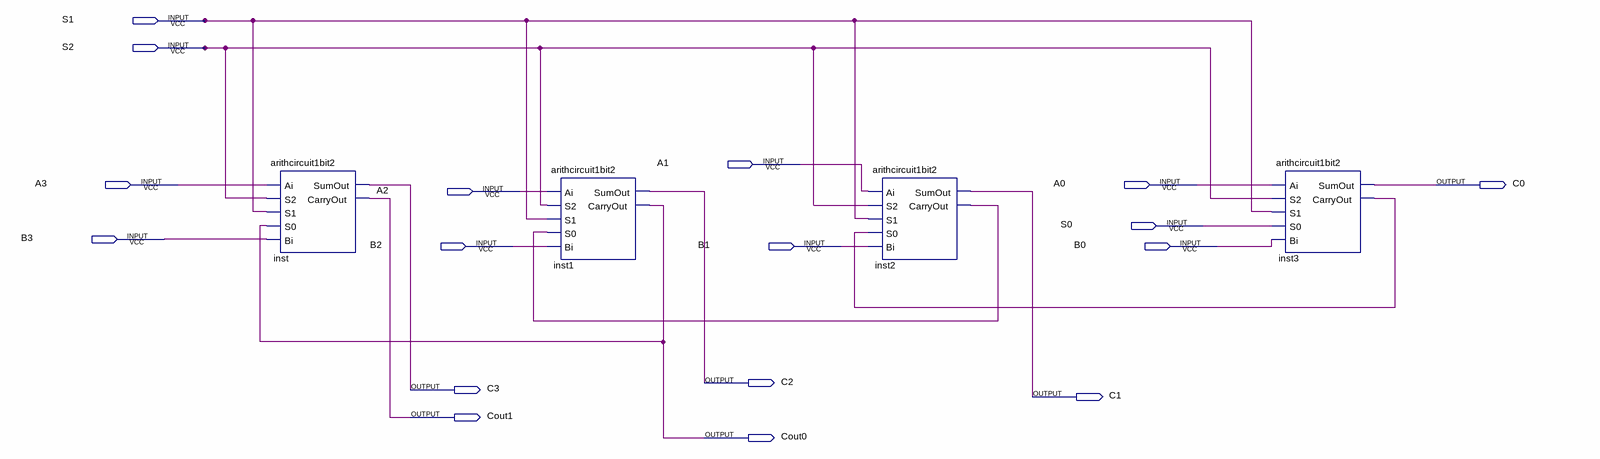
[diagram p0: schematic sheet]
// Quartus schematic arithcircuit4bit2.bdf as structural Verilog: 4 symbols, 17 pins
module arithcircuit4bit2 (
  input  S1,
  input  S2,
  input  A1,
  input  A3,
  input  A0,
  input  A2,
  input  S0,
  input  B3,
  input  B2,
  input  B1,
  input  B0,
  output C0,
  output C2,
  output C3,
  output C1,
  output Cout1,
  output Cout0
);

  wire inst2_carryout, inst3_carryout;

  arithcircuit1bit2 inst (.Ai(A3), .S2(S2), .S1(S1), .S0(Cout0), .Bi(B3), .SumOut(C3), .CarryOut(Cout1));
  arithcircuit1bit2 inst1 (.Ai(A2), .S2(S2), .S1(S1), .S0(inst2_carryout), .Bi(B2), .SumOut(C2), .CarryOut(Cout0));
  arithcircuit1bit2 inst2 (
    .Ai(A1), .S2(S2), .S1(S1), .S0(inst3_carryout), .Bi(B1), .SumOut(C1), .CarryOut(inst2_carryout));
  arithcircuit1bit2 inst3 (.Ai(A0), .S2(S2), .S1(S1), .S0(S0), .Bi(B0), .SumOut(C0), .CarryOut(inst3_carryout));
endmodule
